# EAGLE design rgb_sensor (EAGLE 6.4)
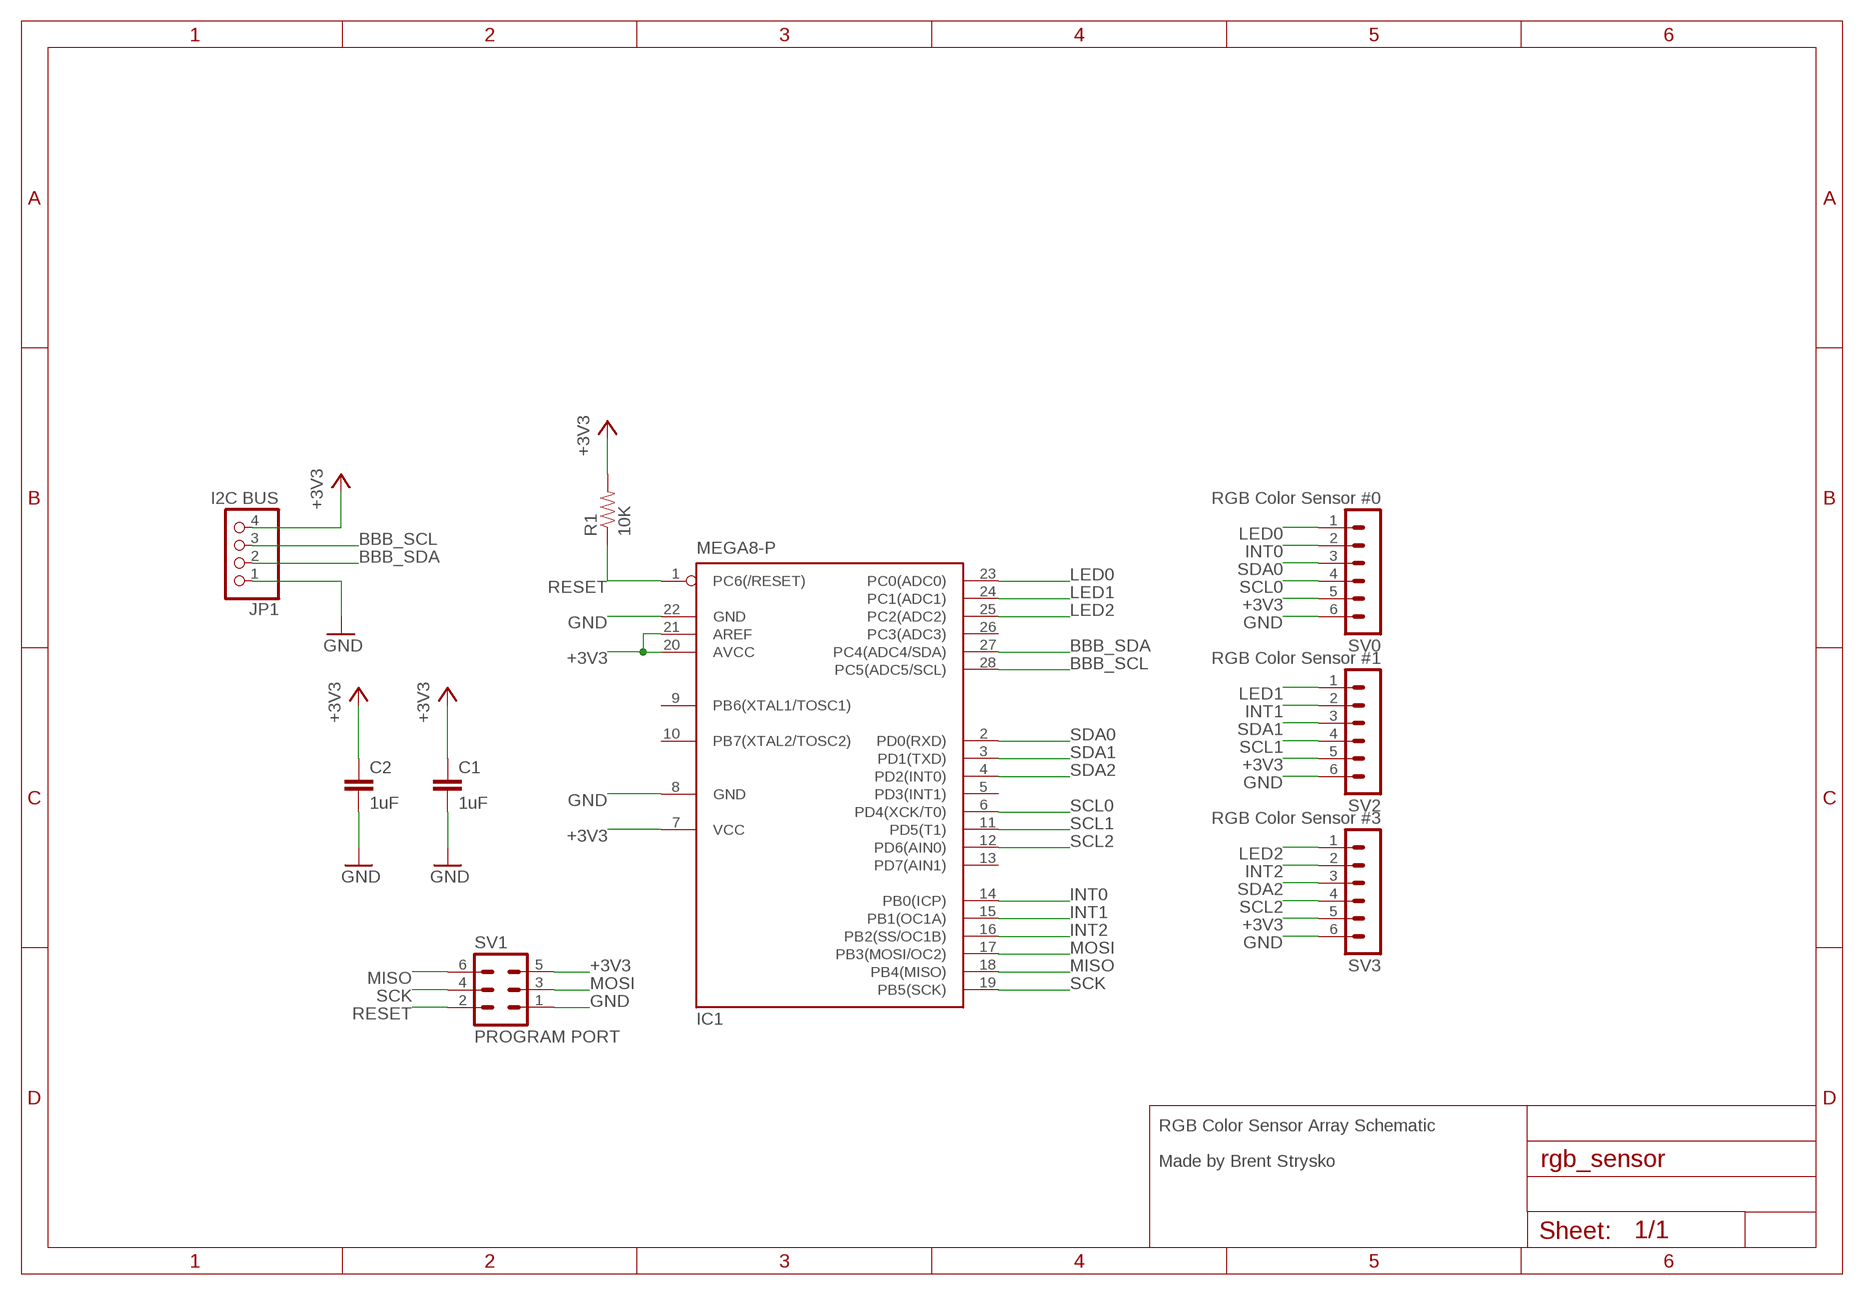
[diagram p0: schematic, sheet 1]

## Parts
C1  1uF  CAPKIT  [CAP-PTH-SMALL-KIT]
C2  1uF  CAPKIT  [CAP-PTH-SMALL-KIT]
IC1  MEGA8-P  [DIL28-3]
JP1  I2C BUS  PINHD-1X4  [1X04]
R1  10K  RESISTORPTH-1/4W  [AXIAL-0.4]
SV0  RGB Color Sensor #0  MA06-1  [MA06-1]
SV1  PROGRAM PORT  MA03-2  [MA03-2]
SV2  RGB Color Sensor #1  MA06-1  [MA06-1]
SV3  RGB Color Sensor #3  MA06-1  [MA06-1]

## Nets
+3V3: C1.1 C2.1 IC1.7(VCC) IC1.20(AVCC) IC1.21(AREF) JP1.4 R1.P$2 SV0.5 SV1.5 SV2.5 SV3.5
BBB_SCL: IC1.28(PC5(ADC5/SCL)) JP1.3
BBB_SDA: IC1.27(PC4(ADC4/SDA)) JP1.2
GND: C1.2 C2.2 IC1.8(GND) IC1.22(GND) JP1.1 SV0.6 SV1.1 SV2.6 SV3.6
INT0: IC1.14(PB0(ICP)) SV0.2
INT1: IC1.15(PB1(OC1A)) SV2.2
INT2: IC1.16(PB2(SS/OC1B)) SV3.2
LED0: IC1.23(PC0(ADC0)) SV0.1
LED1: IC1.24(PC1(ADC1)) SV2.1
LED2: IC1.25(PC2(ADC2)) SV3.1
MISO: IC1.18(PB4(MISO)) SV1.6
MOSI: IC1.17(PB3(MOSI/OC2)) SV1.3
RESET: IC1.1(PC6(/RESET)) R1.P$1 SV1.2
SCK: IC1.19(PB5(SCK)) SV1.4
SCL0: IC1.6(PD4(XCK/T0)) SV0.4
SCL1: IC1.11(PD5(T1)) SV2.4
SCL2: IC1.12(PD6(AIN0)) SV3.4
SDA0: IC1.2(PD0(RXD)) SV0.3
SDA1: IC1.3(PD1(TXD)) SV2.3
SDA2: IC1.4(PD2(INT0)) SV3.3
Unconnected: IC1.5(PD3(INT1)) IC1.9(PB6(XTAL1/TOSC1)) IC1.10(PB7(XTAL2/TOSC2)) IC1.13(PD7(AIN1)) IC1.26(PC3(ADC3))

## Notes on the sheet
- RGB Color Sensor Array Schematic
- Made by Brent Strysko

## Library data of the parts
C1 C2 = SparkFun-Passives:CAP: Capacitor Standard 0603 ceramic capacitor, and 0.1" leaded capacitor.
IC1 = atmel:MEGA8-P: MICROCONTROLLER 8 Kbytes FLASH, 1 kbytes SRAM, 512 bytes EEPROM, USART, 4-channel 10 bit ADC, 2-channel 8 bit ADC Pin compatible with Atmega48, ATMega88, ATMega168 Source: avr.lbr; OC_FARNELL: unknown; OC_NEWARK: unknown
JP1 = pinhead:PINHD-1X4: PIN HEADER
R1 = SparkFun-Passives:RESISTOR: Resistor Basic schematic elements and footprints for 0603, 1206, and PTH resistors.
SV0 SV2 SV3 = con-lstb:MA06-1: PIN HEADER; OC_FARNELL: unknown; OC_NEWARK: unknown
SV1 = con-lstb:MA03-2: PIN HEADER; OC_FARNELL: unknown; OC_NEWARK: unknown

## Board
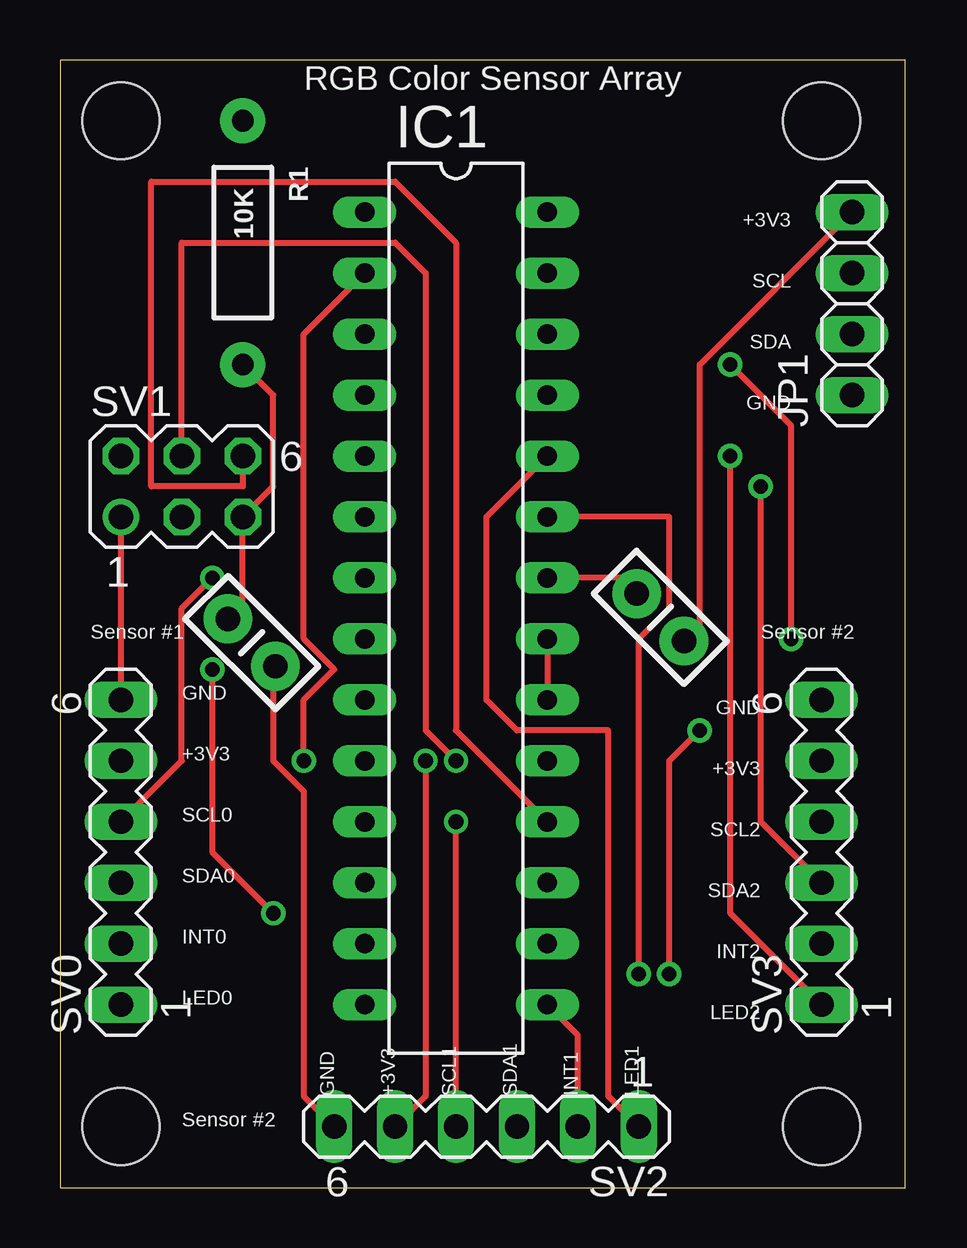
[diagram p1: board, top side]
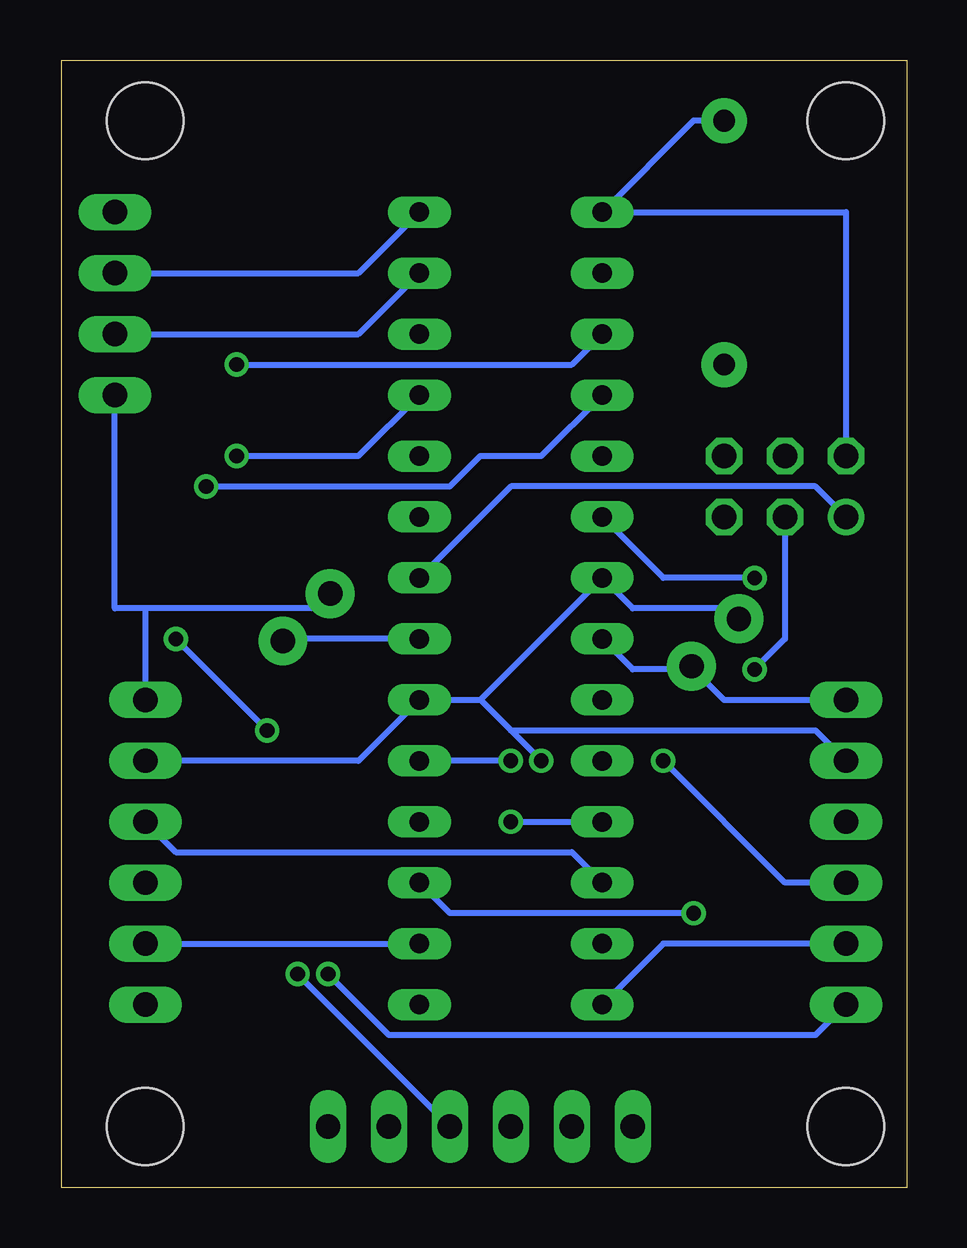
[diagram p2: board, bottom side, seen from below]

Size 35.23 x 46.98 mm. Coordinates in mm from the lower left corner, seen from the top.
Outline: 0,0 35.23,0 35.23,46.98 0,46.98 0,0
Copper layers (1*16): Top 0.035mm / dielectric 1.5mm / Bottom 0.035mm
Design rules "default": minimum track width 10mil, minimum drill 24mil, track to track 8mil, track to pad 8mil, pad to pad 8mil, via to via 8mil, smd to smd 8mil, copper to edge 40mil, drill to drill 8mil, minimum pad ring 10mil, minimum via ring 8mil, stop-mask expansion 4mil, vias tented up to drill 0mil, thermal gap 10mil
Holes 3.2 mm at 31.75,2.54 2.54,44.45 2.54,2.54 31.75,44.45

### Footprints (pad centres in the part's own frame; a part is rotated, then mirrored left to right if it is on the bottom)
CAP-PTH-SMALL-KIT = drill 1.016 pad 2.032: 1 -1.397,0; 2 1.397,0
DIL28-3 = drill 0.813 long: 1 -16.51,-3.81; 2 -13.97,-3.81; 3 -11.43,-3.81; 4 -8.89,-3.81; 5 -6.35,-3.81; 6 -3.81,-3.81; 7 -1.27,-3.81; 8 1.27,-3.81; 9 3.81,-3.81; 10 6.35,-3.81; 11 8.89,-3.81; 12 11.43,-3.81; 13 13.97,-3.81; 14 16.51,-3.81; 15 16.51,3.81; 16 13.97,3.81; 17 11.43,3.81; 18 8.89,3.81; 19 6.35,3.81; 20 3.81,3.81; 21 1.27,3.81; 22 -1.27,3.81; 23 -3.81,3.81; 24 -6.35,3.81; 25 -8.89,3.81; 26 -11.43,3.81; 27 -13.97,3.81; 28 -16.51,3.81
1X04 = drill 1.016 long: 1 -3.81,0; 2 -1.27,0; 3 1.27,0; 4 3.81,0
AXIAL-0.4 = drill 0.9 pad 1.88: P$1 -5.08,0; P$2 5.08,0
MA06-1 = drill 1.016 long: 1 -6.35,0; 2 -3.81,0; 3 -1.27,0; 4 1.27,0; 5 3.81,0; 6 6.35,0
MA03-2 = drill 1.016: 1 -2.54,-1.27 | drill 1.016 octagon: 2 -2.54,1.27; 3 0,-1.27; 4 0,1.27; 5 2.54,-1.27; 6 2.54,1.27

### Placement (x,y rotation side)
C1  25.03,23.76 135 top
C2  7.99,22.71 315 top
IC1  16.51,24.13 270 top
JP1  33.02,36.83 90 top
R1  7.62,39.37 270 top
SV0  2.54,13.97 90 top
SV1  5.08,29.21 0 top
SV2  17.78,2.54 180 top
SV3  31.75,13.97 90 top

### Tracks (layer width: path | path; a pad name or v marks a point on that pad's centre or on a via)
+3V3  (via drill 0.61)
  Top 0.254: JP1.4 26.67,34.29 26.67,22.86 C1.1 | C2.1 7.62,24.13 SV1.5 8.89,29.21 8.89,33.02 R1.P$2 | IC1.21 IC1.20 | SV2.5 15.24,3.81 v15.24,17.78
  Bottom 0.254: C2.1 7.62,24.13 11.43,24.13 IC1.7 17.78,20.32 | 17.78,20.32 16.51,19.05 | 16.51,19.05 v15.24,17.78 | 17.78,20.32 IC1.20 22.86,17.78 SV3.5 | SV0.5 3.81,19.05 16.51,19.05 | IC1.21 25.4,22.86 C1.1
BBB_SCL
  Bottom 0.254: IC1.28 22.86,38.1 JP1.3
BBB_SDA
  Bottom 0.254: IC1.27 22.86,35.56 JP1.2
GND
  Top 0.254: IC1.22 24.13,25.4 C1.2 | SV1.1 SV0.6 | SV2.6 10.16,3.81 10.16,16.51 8.89,17.78 8.89,21.59 C2.2
  Bottom 0.254: 31.75,24.13 SV3.6 | 31.75,24.13 24.13,24.13 C1.2 | JP1.1 33.02,24.13 31.75,24.13 | IC1.8 11.43,21.59 8.89,21.59 | SV0.6 7.62,20.32 8.89,21.59 | 8.89,21.59 C2.2 | IC1.22 16.51,29.21 3.81,29.21 SV1.1
INT0
  Bottom 0.254: IC1.14 10.16,10.16 SV0.2
INT1
  Top 0.254: IC1.15 21.59,6.35 SV2.2
INT2
  Bottom 0.254: SV3.2 IC1.16
LED0  (via drill 0.61)
  Top 0.254: IC1.23 25.4,27.94 25.4,24.13 24.13,22.86 v24.13,8.89
  Bottom 0.254: v24.13,8.89 21.59,6.35 3.81,6.35 SV0.1
LED1
  Top 0.254: IC1.24 17.78,27.94 17.78,20.32 19.05,19.05 22.86,19.05 22.86,3.81 SV2.1
LED2  (via drill 0.61)
  Top 0.254: v27.94,30.48 27.94,11.43 SV3.1
  Bottom 0.254: IC1.25 22.86,30.48 v27.94,30.48
MISO
  Top 0.254: IC1.18 16.51,19.05 16.51,39.37 13.97,41.91 3.81,41.91 3.81,29.21 7.62,29.21 SV1.6
MOSI  (via drill 0.61)
  Top 0.254: v8.89,11.43 6.35,13.97 v6.35,21.59
  Bottom 0.254: IC1.17 19.05,11.43 v8.89,11.43 | v6.35,21.59 5.08,22.86 SV1.3
RESET
  Bottom 0.254: R1.P$1 8.89,44.45 IC1.1 2.54,40.64 SV1.2
SCK  (via drill 0.61)
  Top 0.254: v16.51,17.78 15.24,19.05 15.24,38.1 13.97,39.37 5.08,39.37 SV1.4
  Bottom 0.254: v16.51,17.78 IC1.19
SCL0  (via drill 0.61)
  Top 0.254: v6.35,25.4 5.08,24.13 5.08,17.78 SV0.4
  Bottom 0.254: IC1.6 10.16,25.4 v6.35,25.4
SCL1  (via drill 0.61)
  Top 0.254: SV2.4 v16.51,15.24
  Bottom 0.254: v16.51,15.24 IC1.11
SCL2
  Bottom 0.254: IC1.12 13.97,13.97 30.48,13.97 SV3.4
SDA0  (via drill 0.61)
  Top 0.254: IC1.2 10.16,35.56 10.16,22.86 11.43,21.59 10.16,20.32 v10.16,17.78
  Bottom 0.254: v10.16,17.78 5.08,12.7 SV0.3
SDA1  (via drill 0.61)
  Top 0.254: v27.94,34.29 30.48,31.75 v30.48,22.86 | v26.67,19.05 25.4,17.78 v25.4,8.89
  Bottom 0.254: IC1.3 13.97,34.29 v27.94,34.29 | v26.67,19.05 v30.48,22.86 | SV2.3 v25.4,8.89
SDA2  (via drill 0.61)
  Top 0.254: v29.21,29.21 29.21,15.24 SV3.3
  Bottom 0.254: IC1.4 15.24,30.48 17.78,30.48 19.05,29.21 v29.21,29.21

### Text on the board
tPlace: RGB Color Sensor Array | +3V3 | SCL | SDA | GND | Sensor #1 | Sensor #2 | GND | GND | +3V3 | +3V3 | SCL0 | SCL2 | SDA0 | SDA2 | INT0 | INT2 | LED0 | LED2 | GND | +3V3 | SCL1 | SDA1 | INT1 | LED1 | Sensor #2